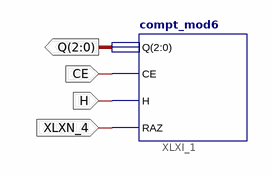
[diagram p0: schematic sheet 1]
// Xilinx ISE schematic modulo.sch (artix7) as structural Verilog: 1 symbols, 4 ports
module modulo (
  input  CE,
  input  H,
  input  XLXN_4,
  output [2:0] Q
);

  compt_mod6 XLXI_1 (.CE(CE), .H(H), .Q(Q), .RAZ(XLXN_4));
endmodule
